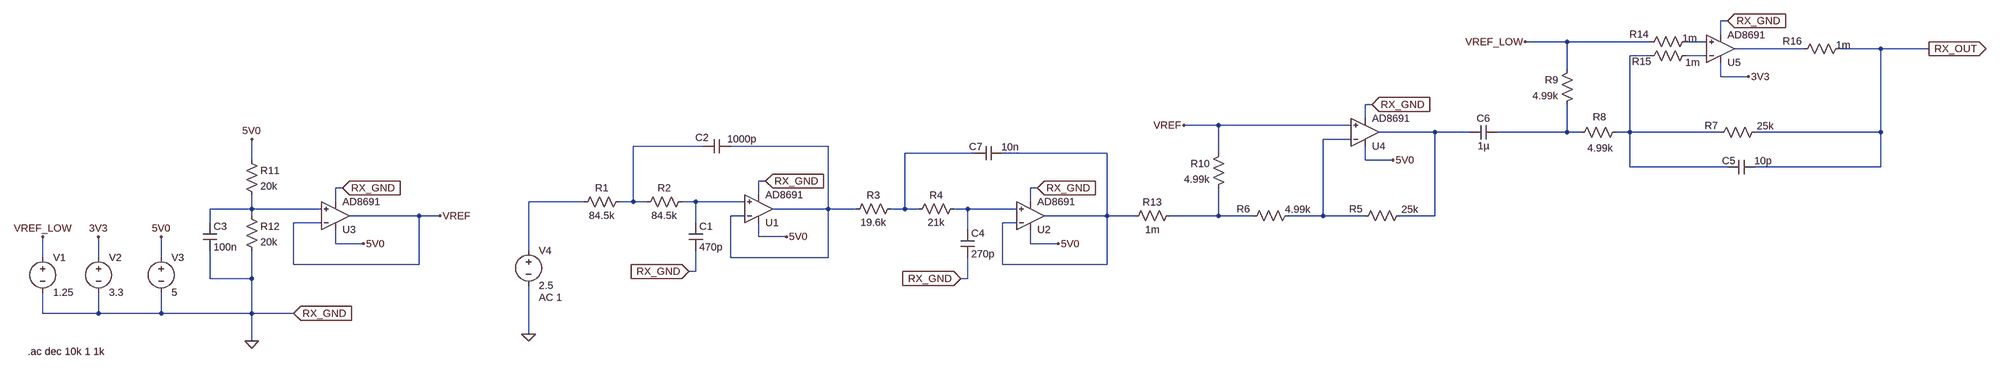
[diagram p0: schematic D1288_Gain and HPF only.asc]
D1288_Gain and HPF only.asc, the LTspice schematic file:
Version 4
SHEET 1 2540 680
WIRE 1888 -112 1872 -112
WIRE 1872 -80 1872 -112
WIRE 1520 -64 1424 -64
WIRE 1712 -64 1520 -64
WIRE 1840 -64 1792 -64
WIRE 2064 -48 1904 -48
WIRE 2240 -48 2144 -48
WIRE 2384 -48 2240 -48
WIRE 1712 -32 1664 -32
WIRE 1840 -32 1792 -32
WIRE 1520 0 1520 -64
WIRE 1872 16 1872 -16
WIRE 1936 16 1872 16
WIRE 1072 80 1056 80
WIRE 1056 112 1056 80
WIRE 720 128 640 128
WIRE 1024 128 720 128
WIRE 1216 144 1088 144
WIRE 1296 144 1216 144
WIRE 1520 144 1520 80
WIRE 1520 144 1360 144
WIRE 1552 144 1520 144
WIRE 1664 144 1664 -32
WIRE 1664 144 1632 144
WIRE 1872 144 1664 144
WIRE 2240 144 2240 -48
WIRE 2240 144 1952 144
WIRE 1024 160 960 160
WIRE -464 176 -624 176
WIRE -176 176 -400 176
WIRE 160 192 0 192
WIRE 464 192 224 192
WIRE 720 192 720 128
WIRE -1776 208 -1776 160
WIRE 1056 208 1056 176
WIRE 1120 208 1056 208
WIRE 1664 224 1664 144
WIRE 1888 224 1664 224
WIRE 2240 224 2240 144
WIRE 2240 224 1952 224
WIRE -320 256 -336 256
WIRE -1568 272 -1584 272
WIRE 304 272 288 272
WIRE -336 288 -336 256
WIRE -1584 304 -1584 272
WIRE -736 304 -864 304
WIRE -624 304 -624 176
WIRE -624 304 -656 304
WIRE -592 304 -624 304
WIRE -480 304 -512 304
WIRE -368 304 -480 304
WIRE 288 304 288 272
WIRE -1776 320 -1776 288
WIRE -1776 320 -1872 320
WIRE -1616 320 -1776 320
WIRE -176 320 -176 176
WIRE -176 320 -304 320
WIRE -112 320 -176 320
WIRE 0 320 0 192
WIRE 0 320 -32 320
WIRE 32 320 0 320
WIRE 144 320 112 320
WIRE 256 320 144 320
WIRE -1776 336 -1776 320
WIRE -1392 336 -1552 336
WIRE -1344 336 -1392 336
WIRE -368 336 -400 336
WIRE 464 336 464 192
WIRE 464 336 320 336
WIRE 528 336 464 336
WIRE 720 336 720 272
WIRE 720 336 608 336
WIRE 800 336 720 336
WIRE 960 336 960 160
WIRE 960 336 880 336
WIRE 1056 336 960 336
WIRE 1216 336 1216 144
WIRE 1216 336 1136 336
WIRE -1872 352 -1872 320
WIRE -1616 352 -1680 352
WIRE -480 352 -480 304
WIRE 256 352 224 352
WIRE 144 368 144 320
WIRE -336 384 -336 352
WIRE -272 384 -336 384
WIRE -1584 400 -1584 368
WIRE -1520 400 -1584 400
WIRE 288 400 288 368
WIRE 352 400 288 400
WIRE -864 416 -864 304
WIRE -2256 432 -2256 384
WIRE -2128 432 -2128 384
WIRE -1984 432 -1984 384
WIRE -400 432 -400 336
WIRE -176 432 -176 320
WIRE -176 432 -400 432
WIRE -1680 448 -1680 352
WIRE -1392 448 -1392 336
WIRE -1392 448 -1680 448
WIRE 224 448 224 352
WIRE 464 448 464 336
WIRE 464 448 224 448
WIRE -480 464 -480 416
WIRE -480 464 -496 464
WIRE -1872 480 -1872 416
WIRE -1776 480 -1776 416
WIRE -1776 480 -1872 480
WIRE 144 480 144 432
WIRE 144 480 128 480
WIRE -2256 560 -2256 512
WIRE -2128 560 -2128 512
WIRE -2128 560 -2256 560
WIRE -1984 560 -1984 512
WIRE -1984 560 -2128 560
WIRE -1776 560 -1776 480
WIRE -1776 560 -1984 560
WIRE -1680 560 -1776 560
WIRE -864 608 -864 496
WIRE -1776 624 -1776 560
FLAG -2256 384 VREF_LOW
FLAG -2128 384 3V3
FLAG -1680 560 RX_GND
IOPIN -1680 560 In
FLAG -1984 384 5V0
FLAG -1344 336 VREF
FLAG -1568 272 RX_GND
IOPIN -1568 272 In
FLAG -1520 400 5V0
FLAG -1776 160 5V0
FLAG -1776 624 0
FLAG -864 608 0
FLAG -320 256 RX_GND
IOPIN -320 256 In
FLAG -496 464 RX_GND
IOPIN -496 464 In
FLAG 304 272 RX_GND
IOPIN 304 272 In
FLAG 128 480 RX_GND
IOPIN 128 480 In
FLAG 1072 80 RX_GND
IOPIN 1072 80 In
FLAG 640 128 VREF
FLAG 1888 -112 RX_GND
IOPIN 1888 -112 In
FLAG 1936 16 3V3
FLAG 1424 -64 VREF_LOW
FLAG 2384 -48 RX_OUT
IOPIN 2384 -48 Out
FLAG -272 384 5V0
FLAG 352 400 5V0
FLAG 1120 208 5V0
DATAFLAG 1536 -64 ""
DATAFLAG 1408 144 ""
DATAFLAG 1232 144 ""
DATAFLAG 784 128 ""
SYMBOL voltage -2256 416 R0
WINDOW 123 0 0 Left 2
WINDOW 39 0 0 Left 2
SYMATTR InstName V1
SYMATTR Value 1.25
SYMBOL voltage -2128 416 R0
WINDOW 123 0 0 Left 2
WINDOW 39 0 0 Left 2
SYMATTR InstName V2
SYMATTR Value 3.3
SYMBOL voltage -1984 416 R0
WINDOW 123 0 0 Left 2
WINDOW 39 0 0 Left 2
SYMATTR InstName V3
SYMATTR Value 5
SYMBOL res -1792 192 R0
SYMATTR InstName R11
SYMATTR Value 20k
SYMBOL res -1792 320 R0
SYMATTR InstName R12
SYMATTR Value 20k
SYMBOL cap -1888 352 R0
SYMATTR InstName C3
SYMATTR Value 100n
SYMBOL Opamps\\AD8691 -1584 400 M180
SYMATTR InstName U3
SYMBOL voltage -864 400 R0
WINDOW 123 24 124 Left 2
WINDOW 39 0 0 Left 0
SYMATTR InstName V4
SYMATTR Value 2.5
SYMATTR Value2 AC 1
SYMBOL res -640 288 R90
WINDOW 0 0 56 VBottom 2
WINDOW 3 32 56 VTop 2
SYMATTR InstName R1
SYMATTR Value 84.5k
SYMBOL res -496 288 R90
WINDOW 0 0 56 VBottom 2
WINDOW 3 32 56 VTop 2
SYMATTR InstName R2
SYMATTR Value 84.5k
SYMBOL cap -496 352 R0
SYMATTR InstName C1
SYMATTR Value 470p
SYMBOL cap -400 160 R90
WINDOW 0 12 66 VBottom 2
WINDOW 3 -16 -26 VTop 2
SYMATTR InstName C2
SYMATTR Value 1000p
SYMBOL res -16 304 R90
WINDOW 0 0 56 VBottom 2
WINDOW 3 32 56 VTop 2
SYMATTR InstName R3
SYMATTR Value 19.6k
SYMBOL res 128 304 R90
WINDOW 0 0 56 VBottom 2
WINDOW 3 32 56 VTop 2
SYMATTR InstName R4
SYMATTR Value 21k
SYMBOL cap 128 368 R0
SYMATTR InstName C4
SYMATTR Value 270p
SYMBOL res 1040 352 R270
WINDOW 0 16 -5 VTop 2
WINDOW 3 46 119 VBottom 2
SYMATTR InstName R5
SYMATTR Value 25k
SYMBOL res 784 352 R270
WINDOW 0 16 -7 VTop 2
WINDOW 3 46 118 VBottom 2
SYMATTR InstName R6
SYMATTR Value 4.99k
SYMBOL res 1856 160 R270
WINDOW 0 16 -5 VTop 2
WINDOW 3 46 119 VBottom 2
SYMATTR InstName R7
SYMATTR Value 25k
SYMBOL cap 1952 208 R90
WINDOW 0 17 61 VBottom 2
WINDOW 3 -14 -18 VTop 2
SYMATTR InstName C5
SYMATTR Value 10p
SYMBOL res 1536 160 R270
WINDOW 0 36 58 VTop 2
WINDOW 3 -5 60 VBottom 2
SYMATTR InstName R8
SYMATTR Value 4.99k
SYMBOL res 1536 -16 M0
SYMATTR InstName R9
SYMATTR Value 4.99k
SYMBOL res 736 176 M0
SYMATTR InstName R10
SYMATTR Value 4.99k
SYMBOL res 624 320 R90
WINDOW 0 0 56 VBottom 2
WINDOW 3 32 56 VTop 2
SYMATTR InstName R13
SYMATTR Value 1m
SYMBOL Opamps\\AD8691 -336 384 M180
SYMATTR InstName U1
SYMBOL Opamps\\AD8691 288 400 M180
SYMATTR InstName U2
SYMBOL Opamps\\AD8691 1056 208 M180
SYMATTR InstName U4
SYMBOL Opamps\\AD8691 1872 16 M180
SYMATTR InstName U5
SYMBOL cap 1360 128 R90
WINDOW 0 0 32 VBottom 2
WINDOW 3 32 32 VTop 2
SYMATTR InstName C6
SYMATTR Value 1µ
SYMATTR SpiceLine V=16 Irms=2.59 Rser=0.0171188 Lser=0 mfg="KEMET" pn="C0603C105K4RAC" type="X7R"
SYMBOL cap 224 176 R90
WINDOW 0 17 61 VBottom 2
WINDOW 3 -14 -18 VTop 2
SYMATTR InstName C7
SYMATTR Value 10n
SYMATTR SpiceLine V=50 Irms=247m Rser=0.759039 Lser=0 mfg="KEMET" pn="C0603C103K5RAC" type="X7R"
SYMBOL res 1808 -80 R90
WINDOW 0 14 123 VBottom 2
WINDOW 3 -8 6 VTop 2
SYMATTR InstName R14
SYMATTR Value 1m
SYMBOL res 1808 -48 R90
WINDOW 0 45 117 VBottom 2
WINDOW 3 16 0 VTop 2
SYMATTR InstName R15
SYMATTR Value 1m
SYMBOL res 2160 -64 R90
WINDOW 0 14 123 VBottom 2
WINDOW 3 -8 6 VTop 2
SYMATTR InstName R16
SYMATTR Value 1m
TEXT -2290 648 Left 2 !.ac dec 10k 1 1k

The netlist it stands for:
* D1288_Gain and HPF only.asc
V1 VREF_LOW 0 1.25
V2 3V3 0 3.3
V3 5V0 0 5
R11 5V0 N014 20k
R12 N014 0 20k
C3 N014 0 100n
XU3 N014 VREF 5V0 0 VREF AD8691  ; pins In+ In- V+ V- OUT
V4 N012 0 2.5 AC 1
R1 N008 N012 84.5k
R2 N013 N008 84.5k
C1 N013 0 470p
C2 N009 N008 1000p
R3 N010 N009 19.6k
R4 N015 N010 21k
C4 N015 0 270p
R5 N007 N005 25k
R6 N016 N007 4.99k
R7 N003 RX_OUT 25k
C5 RX_OUT N003 10p
R8 N006 N003 4.99k
R9 VREF_LOW N006 4.99k
R10 VREF N016 4.99k
R13 N016 N011 1m
XU1 N013 N009 5V0 0 N009 AD8691  ; pins In+ In- V+ V- OUT
XU2 N015 N011 5V0 0 N011 AD8691  ; pins In+ In- V+ V- OUT
XU4 VREF N007 5V0 0 N005 AD8691  ; pins In+ In- V+ V- OUT
XU5 N001 N004 3V3 0 N002 AD8691  ; pins In+ In- V+ V- OUT
C6 N006 N005 1µ V=16 Irms=2.59 Rser=0.0171188 Lser=0 mfg="KEMET" pn="C0603C105K4RAC" type="X7R"
C7 N011 N010 10n V=50 Irms=247m Rser=0.759039 Lser=0 mfg="KEMET" pn="C0603C103K5RAC" type="X7R"
R14 N001 VREF_LOW 1m
R15 N004 N003 1m
R16 RX_OUT N002 1m
.ac dec 10k 1 1k
.backanno
.end